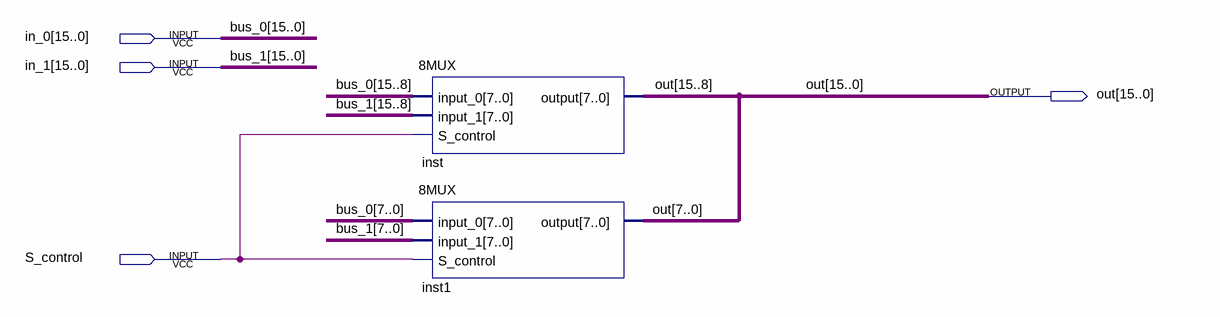
[diagram p0: schematic sheet]
// Quartus schematic 16MUX.bdf as structural Verilog: 2 symbols, 4 pins
module \16MUX  (
  input  [15:0] in_0,
  input  [15:0] in_1,
  input  S_control,
  output [15:0] out
);

  \8MUX  inst (.input_0(in_0[15:8]), .input_1(in_1[15:8]), .S_control(S_control), .\output (out[15:8]));
  \8MUX  inst1 (.input_0(in_0[7:0]), .input_1(in_1[7:0]), .S_control(S_control), .\output (out[7:0]));

  // Other names for the same wires on the sheet: bus_0[15:0] = in_0; bus_1[15:0] = in_1
endmodule
